# EAGLE design RecalLED (EAGLE 9.2.1)
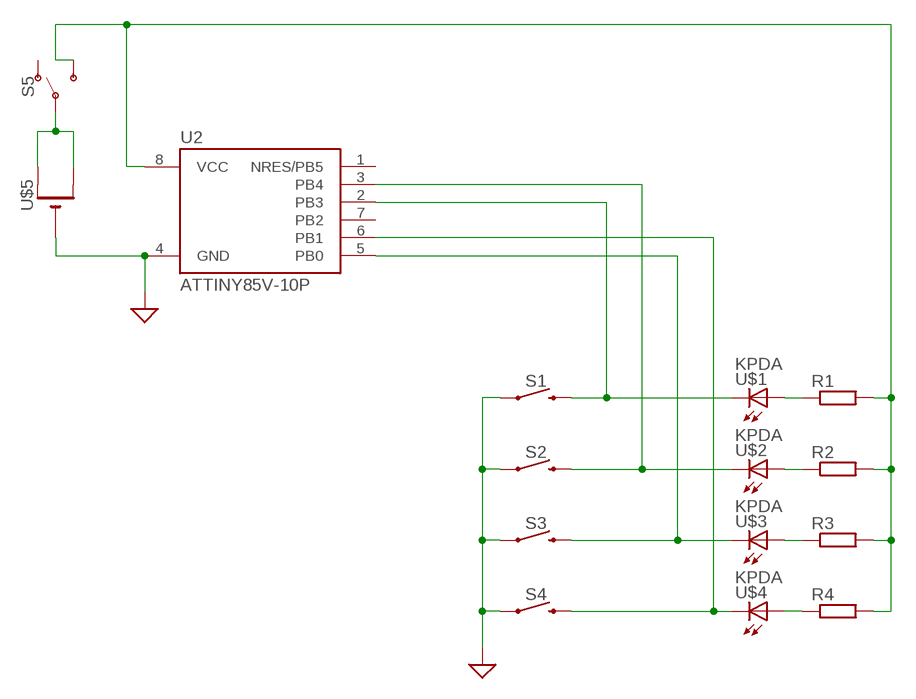
[diagram p0: schematic, sheet 1]

## Parts
R1  R-EU_M0805  [M0805]
R2  R-EU_M0805  [M0805]
R3  R-EU_M0805  [M0805]
R4  R-EU_M0805  [M0805]
S1  MOMENTARY-SWITCH-SPST-SMD-6.2MM-TALL  [TACTILE_SWITCH_SMD_6.2MM_TALL]
S2  MOMENTARY-SWITCH-SPST-SMD-6.2MM-TALL  [TACTILE_SWITCH_SMD_6.2MM_TALL]
S3  MOMENTARY-SWITCH-SPST-SMD-6.2MM-TALL  [TACTILE_SWITCH_SMD_6.2MM_TALL]
S4  MOMENTARY-SWITCH-SPST-SMD-6.2MM-TALL  [TACTILE_SWITCH_SMD_6.2MM_TALL]
S5  SWITCH-SPDT-SMD-RIGHT-ANGLE  [SWITCH_SPST_SMD_A]
U2  ATTINY85V-10P  [PDIP08_300MIL]
U$1  KPDA  [KPDA]
U$2  KPDA  [KPDA]
U$3  KPDA  [KPDA]
U$4  KPDA  [KPDA]
U$5  CR2032SMT  [CR2032-SMD]

## Nets
GND: S1.A2 S2.A2 S3.A2 S4.A2 U2.4(GND) U$5.- ; supply symbol labelled SUP
N$2: S1.B2 U2.2(PB3) U$1.P$2(C)
N$3: S2.B2 U2.3(PB4) U$2.P$2(C)
N$4: S3.B2 U2.5(PB0) U$3.P$2(C)
N$5: S4.B2 U2.6(PB1) U$4.P$2(C)
N$6: R4.1 U$4.P$1(A)
N$7: R3.1 U$3.P$1(A)
N$8: R2.1 U$2.P$1(A)
N$9: R1.1 U$1.P$1(A)
N$10: S5.2(P) U$5.+$1(+) U$5.+$2(+1)
N$11: R1.2 R2.2 R3.2 R4.2 S5.3(S) U2.8(VCC)
Unconnected: S5.1(O) U2.1(NRES/PB5) U2.7(PB2)

## Library data of the parts
R1-R4 = rcl:R-EU_: RESISTOR, European symbol; SPICEPREFIX: R
S1-S4 = SparkFun-Switches:MOMENTARY-SWITCH-SPST: Momentary Switch (Pushbutton) - SPST Normally-open (NO) SPST momentary switches (buttons, pushbuttons). Variants PTH-12MM - 12mm square, through-hole Momentary Pushbutton Switch - 12mm Square <https://www.sparkfun.com/products/9190> (COM-09190) PTH-6.0MM, PTH-6.0MM-KIT - 6.0mm square, through-hole Mini Pushbutton Switch <https://www.sparkfun.com/products/97> (COM-00097) KIT package intended for soldering kit's - only one side of pads' copper is exposed. PTH-RIGHT-ANGLE-KIT - Right-angle, through-hole Right Angle Tactile Button <https://www.sparkfun.com/products/10791> - Used on SparkFun BigTime Watch Kit <https://www.sparkfun.com/products/11734> SMD-12MM - 12mm square, surface-mount Tactile Button - SMD (12mm) <https://www.sparkfun.com/products/12993> (COM-12993) Used on SparkFun PicoBoard <https://www.sparkfun.com/products/11888> SMD-4.5MM - 4.5mm Square Trackball Switch Used on SparkFun Blackberry Trackballer Breakout <https://www.sparkfun.com/products/13169> SMD-4.6MMX2.8MM - 4.60mm x 2.80mm, surface mount Used on SparkFun SAMD21 Mini Breakout <https://www.sparkfun.com/products/13664> SMD-5.2MM, SMD-5.2-REDUNDANT - 5.2mm square, surface-mount Mini Pushbutton Switch - SMD <https://www.sparkfun.com/products/8720> (COM-08720) Used on Arduino Pro Mini <https://www.sparkfun.com/products/11114> REDUNDANT package connects both switch circuits together SMD-6.0X3.5MM - 6.0 x 3.5mm, surface mount Momentary Reset Switch SMD <https://www.sparkfun.com/products/8229> (COM-08229) SMD-6.2MM-TALL - 6.2mm square, surface mount Tactile Button - SMD (6mm) <https://www.sparkfun.com/products/12992> Used on SparkFun Digital Sandbox <https://www.sparkfun.com/products/12651> SMD-RIGHT-ANGLE - Right-angle, surface mount Used on SparkFun Block for Intel® Edison - Arduino <https://www.sparkfun.com/products/13036>; PROD_ID: SWCH-11966; SF_SKU: COM-12992
S5 = SparkFun-Switches:SWITCH-SPDT: Single Pole, Double Throw (SPDT) Switch Single-pole, double-throw (SPDT) switch. Variant Overview SMD-AYZ0202 Surface Mount DPDT Switch <https://www.sparkfun.com/products/597> (COM-00597) Used on e.g. LilyPad Arduino USB - ATmega32U4 Board <https://www.sparkfun.com/products/12049> PTH-11.6X4.0MM SPDT Mini Power Switch <https://www.sparkfun.com/products/102> (COM-00102) Used on e.g. SparkFun Simon Says - Through-Hole Soldering Kit <https://www.sparkfun.com/products/10547> (KIT-10547) PTH-11.6X4.0MM-KIT KIT version of SPDT Mini Power Switch - Simplifies soldering by removing tStop of switch pins - only one side can be soldered. PTH-11.6X4.0MM-LOCK LOCK version of SPDT Mini Power Switch - Offset pins hold switch in place for easier soldering. SMD-RIGHT-ANGLE Surface Mount Right Angle Switch <https://www.sparkfun.com/products/10860> (COM-10860) Used on e.g. SparkFun ESP8266 Thing <https://www.sparkfun.com/products/13231>; PROD_ID: SWCH-10651; SF_SKU: COM-10860
U2 = _hhn_attiny25_45_85:ATTINY85*: ATMEL ATtiny 85 Packages: P = PDIP 08 30mil S = SOIC 08 EIAJ 208mil Technologies Note: for complete ordering code (temp. range, finish, tape&reel etc.) see www.atmel.com • Supply Voltage: V = (1.8…5.5)V | [blank] = (2.7…5.5)V • Speed: 10 = 10 MHz | 20 = 20 MHz Author: Dipl.-Ing. FH Rainer Bayer HHN Hochschule Heilbronn (Heilbronn University), rainer.bayer@hs-heilbronn.de Ingenieurbüro ing-rb, mail@ing-rb.de
U$1-U$4 = Personal:KPDA
U$5 = adafruit:CR2032

## Board
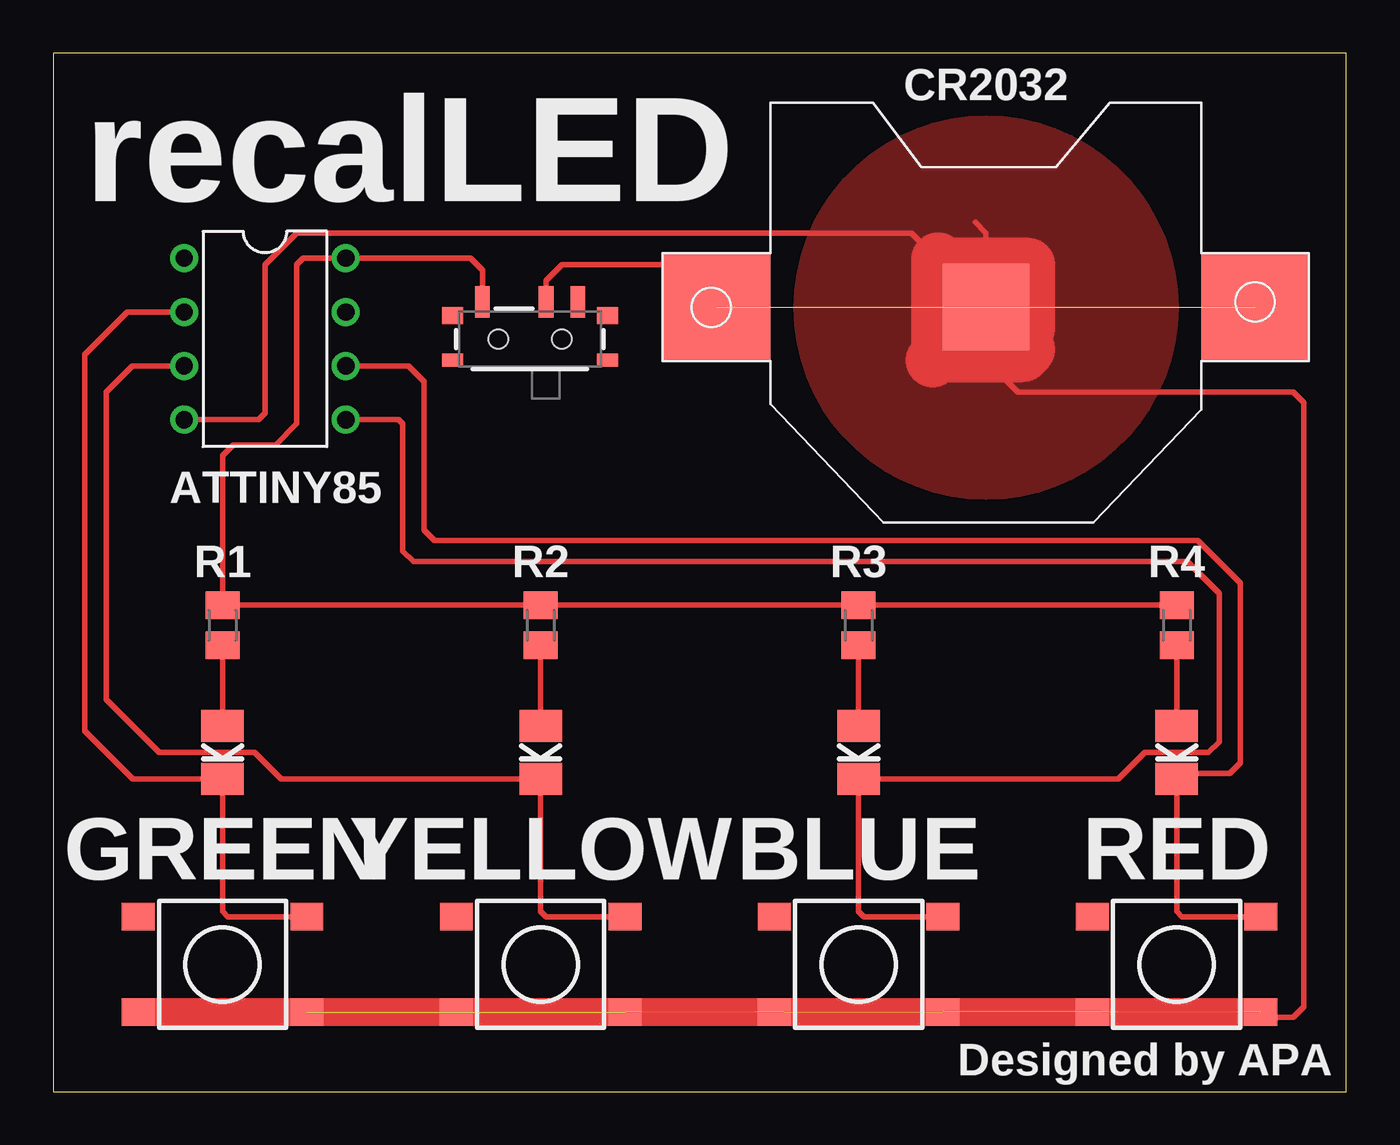
[diagram p1: board, top side]

Size 61.01 x 48.99 mm. Coordinates in mm from the lower left corner, seen from the top.
Outline: 0,0 61,0 61.01,48.99 0,48.98 0,0
Copper layers (1*16): Top 0.035mm / dielectric 1.5mm / Bottom 0.035mm
Design rules "default": minimum track width 6mil, minimum drill 0.35mm, track to track 6mil, track to pad 6mil, pad to pad 6mil, via to via 6mil, smd to smd 6mil, copper to edge 40mil, drill to drill 6mil, minimum pad ring 10mil, minimum via ring 8mil, stop-mask expansion 4mil, vias tented up to drill 0mil, thermal gap 10mil

### Footprints (pad centres in the part's own frame; a part is rotated, then mirrored left to right if it is on the bottom)
M0805 = smd 1.3 x 1.6: 1 -0.95,0; 2 0.95,0
TACTILE_SWITCH_SMD_6.2MM_TALL = smd 1.55 x 1.3: A1 -3.975,-2.25; A2 3.975,-2.25; B1 -3.975,2.25; B2 3.975,2.25
SWITCH_SPST_SMD_A = smd 0.7 x 1.5: 1 -2.25,-1.75; 2 -0.75,-1.75; 3 2.25,-1.75 | smd 1 x 0.6: GND1 -3.65,1; GND3 3.65,1 | smd 1 x 0.8: GND2 -3.65,-1.1; GND4 3.65,-1.1 | hole 0.9: -1.5,0; 1.5,0
PDIP08_300MIL = drill 0.813: 1 -3.81,-3.81; 2 -1.27,-3.81; 3 1.27,-3.81; 4 3.81,-3.81; 5 3.81,3.81; 6 1.27,3.81; 7 -1.27,3.81; 8 -3.81,3.81
KPDA = smd 2 x 1.5: P$1 0,1.25; P$2 0,-1.25
CR2032-SMD = smd 5.08 x 5.08: +$1 -12.7,0; +$2 12.7,0 | smd 4.064 x 4.064: - 0,0

### Placement (x,y rotation side)
R1  8,22 90 top
R2  23,22 90 top
R3  38,22 90 top
R4  53,22 90 top
S1  8,6 0 top
S2  23,6 0 top
S3  38,6 0 top
S4  53,6 0 top
S5  22.5,35.5 180 top
U2  10,35.5 270 top
U$1  8,16 0 top
U$2  23,16 0 top
U$3  38,16 0 top
U$4  53,16 0 top
U$5  44,37 0 top

### Tracks (layer width: path | path; a pad name or v marks a point on that pad's centre or on a via)
GND  (3 unrouted)
  Top 0.25: 57,3.77 S4.A2 57.23,3.5 58.5,3.5 59,4 59,32.5 58.5,33 45.5,33 44,34.5 U$5.- | S3.A2 42,3.77 | S2.A2 27,3.77 | U$5.- 44.52,37 | 43.5,41 44,40.5 U$5.- | U$5.- 41.5,34.5 41,34.5 | 46,39 46.5,39.5 46.5,40 | U$5.- 42,39 41.75,39.25 40.5,40.5 11.5,40.5 10,39 10,32 9.69,31.69 U2.4 | U$5.- 46,35 46.5,34.5 47,34.5
  Top 2.54: 41.75,39.25 41.75,34.75 | 41.75,34.75 41.5,34.5 | 41.75,34.75 45.75,34.75 46,35 | U$5.- 45,37 46,36 46,39 42,39
  pour Top: 34.98,36.98 arc-90 44.02,46.02 arc-90 53.05,36.98 arc-90 44.01,27.95 arc-90
N$2
  Top 0.25: S1.B2 8.25,8.25 8,8.5 U$1.P$2 3.75,14.75 1.5,17 1.5,34.77 3.5,36.77 U2.2
N$3
  Top 0.25: S2.B2 23.25,8.25 23,8.5 U$2.P$2 10.75,14.75 9.5,16 5,16 2.5,18.5 2.5,33 3.73,34.23 U2.3
N$4
  Top 0.25: S3.B2 38.25,8.25 38,8.5 U$3.P$2 50.25,14.75 51.5,16 54.5,16 55,16.5 55,23.5 53.5,25 17,25 16.5,25.5 16.5,31.5 16.31,31.69 U2.5
N$5
  Top 0.25: S4.B2 53.25,8.25 53,8.5 U$4.P$2 53.25,15 55.5,15 56,15.5 56,24 54,26 18,26 17.5,26.5 17.5,33.5 16.77,34.23 U2.6
N$6
  Top 0.25: U$4.P$1 R4.1
N$7
  Top 0.25: U$3.P$1 R3.1
N$8
  Top 0.25: U$2.P$1 R2.1
N$9
  Top 0.25: U$1.P$1 R1.1
N$10  (1 unrouted)
  Top 0.25: U$5.+$1 31.3,37.7 30,39 24,39 23.25,38.25 S5.2
N$11
  Top 0.25: R4.2 R3.2 R2.2 R1.2 8,30 8.5,30.5 10.5,30.5 11.5,31.5 11.5,39 11.81,39.31 U2.8 19.69,39.31 20.25,38.75 S5.3
(copper drawn outside any net)
  shapes: Top area x1

### Text on the board
tPlace: recalLED
tNames: CR2032 | ATTINY85 | R1 | R2 | R3 | R4 | GREEN | YELLOW | BLUE | RED | Designed by APA